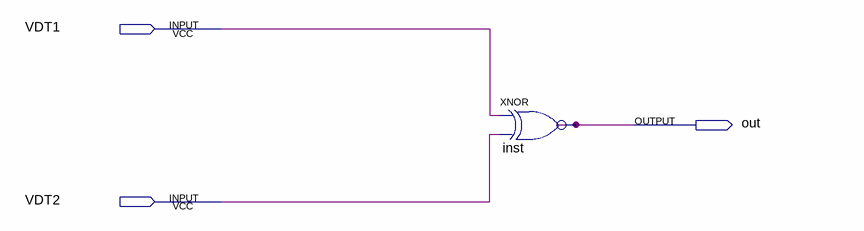
[diagram p0: schematic sheet]
// Quartus schematic assignmet7.bdf as structural Verilog: 1 symbols, 3 pins
module assignmet7 (
  input  VDT1,
  input  VDT2,
  output out
);

  xnor inst (out, VDT1, VDT2);
endmodule
